# EAGLE design Hypnos V2_2.24 (EAGLE 9.5.2)
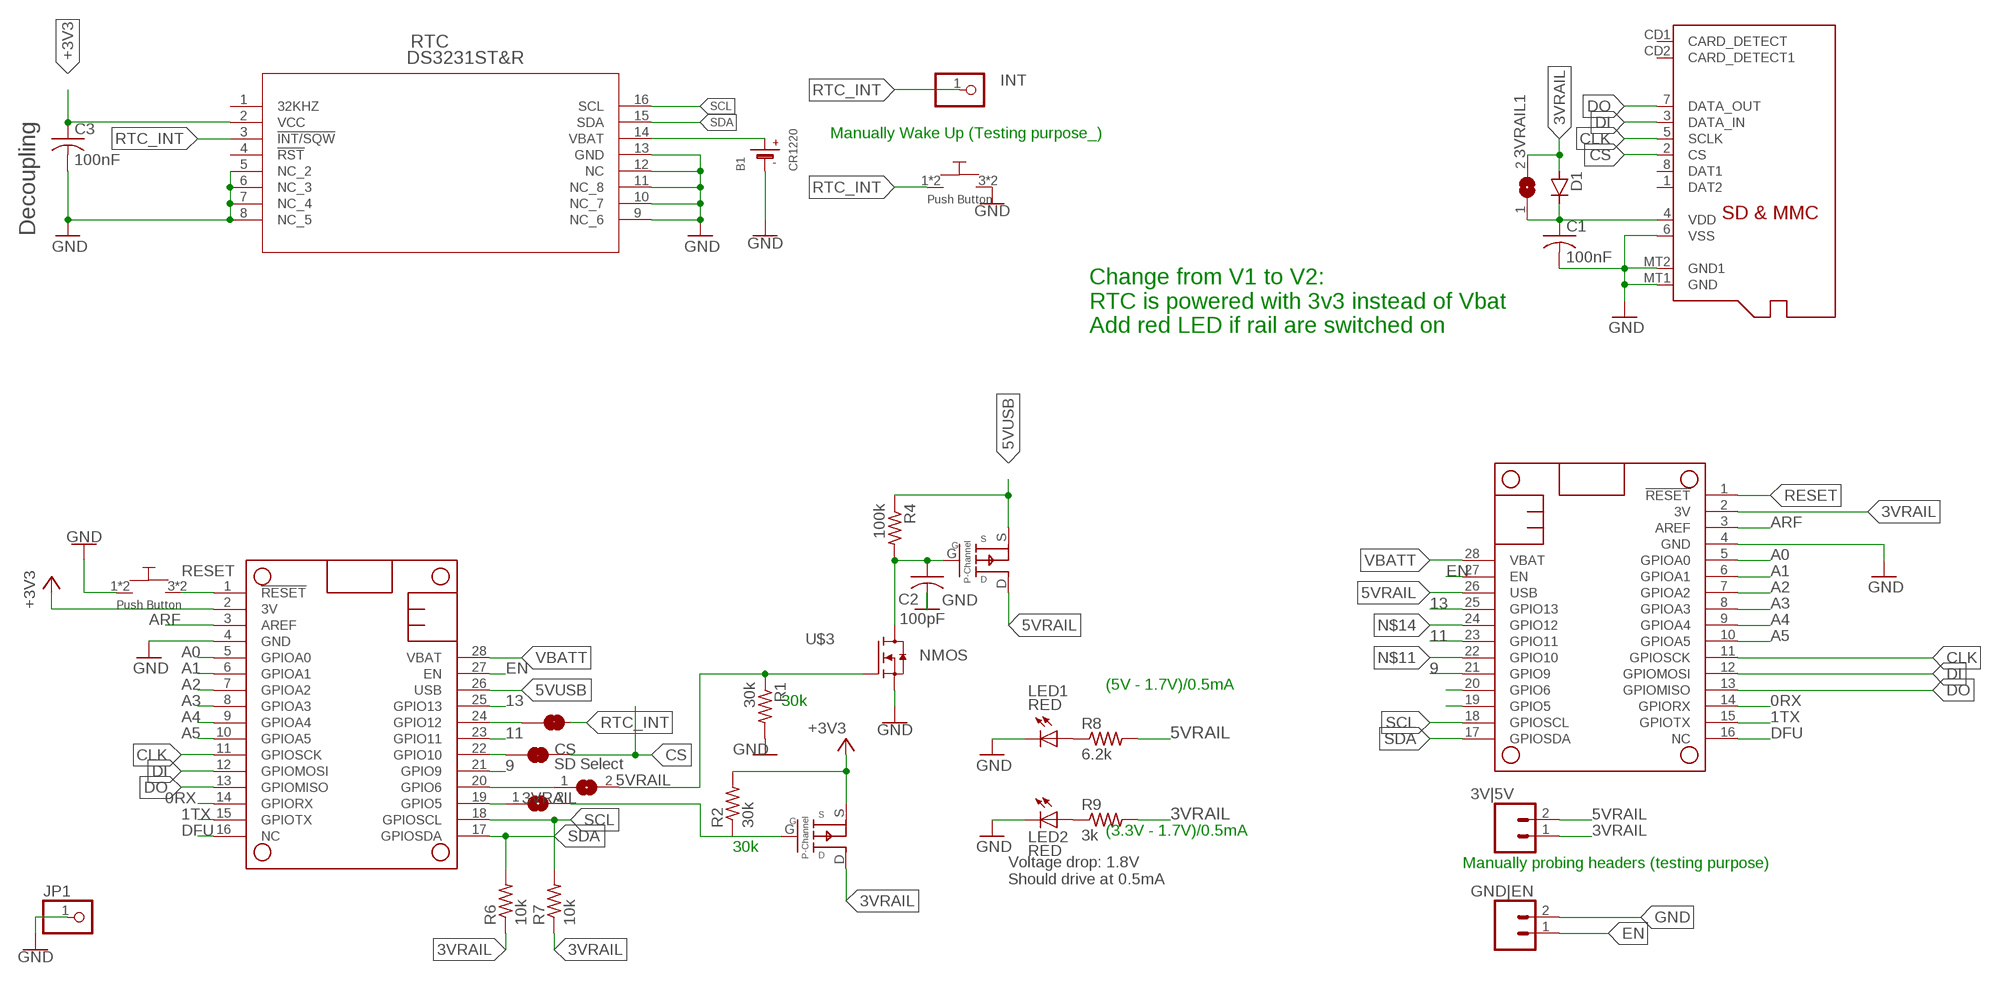
[diagram p0: schematic, sheet 1]

## Parts
3VRAIL  SJ  [SJ]
3VRAIL1  SJ  [SJ]
3V|5V  CONN_021X02_NO_SILK  [1X02_NO_SILK]
5VRAIL  SJ  [SJ]
B1  CR1220  BATTERYCR1220_SMT  [CR1220]
C1  100nF  C-USC1206  [C1206]
C2  100pF  C-USC0805  [C0805]
C3  100nF  C-USC1206  [C1206]
CS  SD Select  JUMPER-SMT_2_NC_TRACE_SILK  [SMT-JUMPER_2_NC_TRACE_SILK]
D1  D-SOD123  [SOD123]
GND|EN  CONN_021X02_NO_SILK  [1X02_NO_SILK]
INT  PINHD-1X1CB  [1X01-CLEANBIG]
JP1  PINHD-1X1CB  [1X01-CLEANBIG]
LED1  RED  LEDCHIPLED_0805  [CHIPLED_0805]
LED2  RED  LEDCHIPLED_0805  [CHIPLED_0805]
MICROSD  MICROSD  [MICROSD]
MS1  FEATHERWING  [FEATHERWING]
MS2  FEATHERWING  [FEATHERWING]
PMOS1  SSM3J3228R  [SOT-23-3]
PMOS2  SSM3J3228R  [SOT-23-3]
R1  30k  WSLP1206R0500FEA  [RES_1206]
R2  30k  WSLP1206R0500FEA  [RES_1206]
R4  100k  WSLP1206R0500FEA  [RES_1206]
R6  10k  WSLP1206R0500FEA  [RES_1206]
R7  10k  WSLP1206R0500FEA  [RES_1206]
R8  6.2k  WSLP1206R0500FEA  [RES_1206]
R9  3k  WSLP1206R0500FEA  [RES_1206]
RTC  DS3231ST&R  [21-0042B_16]
RTC_INT  JUMPER-SMT_2_NC_TRACE_SILK  [SMT-JUMPER_2_NC_TRACE_SILK]
U$1  PUSH_BUTTON  [PUSHBUTTON_SMD]
U$2  PUSH_BUTTON  [PUSHBUTTON_SMD]
U$3  NMOS  [SOT23-S]

## Nets
0RX: MS1.14(GPIORX) MS2.14(GPIORX)
1TX: MS1.15(GPIOTX) MS2.15(GPIOTX)
3VRAIL: 3VRAIL1.2 3V|5V.1 D1.2(A) MS1.2(3V) PMOS2.D R6.1 R7.1 R9.2
5VRAIL: 3V|5V.2 MS1.26(USB) PMOS1.D R8.2
5VUSB: MS2.26(USB) PMOS1.S R4.1
9: MS1.21(GPIO9) MS2.21(GPIO9)
11: MS1.23(GPIO11) MS2.23(GPIO11)
13: MS1.25(GPIO13) MS2.25(GPIO13)
+3V3: C3.1 MS2.2(3V) PMOS2.S R2.2 RTC.2(VCC)
A0: MS1.5(GPIOA0) MS2.5(GPIOA0)
A1: MS1.6(GPIOA1) MS2.6(GPIOA1)
A2: MS1.7(GPIOA2) MS2.7(GPIOA2)
A3: MS1.8(GPIOA3) MS2.8(GPIOA3)
A4: MS1.9(GPIOA4) MS2.9(GPIOA4)
A5: MS1.10(GPIOA5) MS2.10(GPIOA5)
ARF: MS1.3(AREF) MS2.3(AREF)
CLK: MICROSD.5(SCLK) MS1.11(GPIOSCK) MS2.11(GPIOSCK)
CS: CS.2 MICROSD.2(CS)
DFU: MS1.16(NC) MS2.16(NC)
DI: MICROSD.3(DATA_IN) MS1.12(GPIOMOSI) MS2.12(GPIOMOSI)
DO: MICROSD.7(DATA_OUT) MS1.13(GPIOMISO) MS2.13(GPIOMISO)
EN: GND|EN.1 MS1.27(EN) MS2.27(EN)
GND: B1.- C1.2 C2.2 C3.2 GND|EN.2 JP1.1 LED1.C LED2.C MICROSD.6(VSS) MICROSD.MT1(GND) MICROSD.MT2(GND1) MS1.4(GND) MS2.4(GND) R1.2 RTC.5(NC_2) RTC.6(NC_3) RTC.7(NC_4) RTC.8(NC_5) RTC.9(NC_6) RTC.10(NC_7) RTC.11(NC_8) RTC.12(NC) RTC.13(GND) U$1.1 U$1.2 U$2.3 U$2.4 U$3.2(S)
N$1: 5VRAIL.1 MS2.20(GPIO6)
N$2: B1.+$1(+) RTC.14(VBAT)
N$3: 3VRAIL.1 MS2.19(GPIO5)
N$4: 5VRAIL.2 R1.1 U$3.1(G)
N$5: 3VRAIL.2 PMOS2.G R2.1
N$7: MS1.20(GPIO6)
N$8: MS1.19(GPIO5)
N$10: C2.1 PMOS1.G R4.2 U$3.3(D)
N$11: CS.1 MS1.22(GPIO10) MS2.22(GPIO10)
N$12: LED1.A R8.1
N$13: LED2.A R9.1
N$14: MS1.24(GPIO12) MS2.24(GPIO12) RTC_INT.1
RESET: MS1.1(!RESET) MS2.1(!RESET) U$1.3 U$1.4
RTC_INT [sig]: INT.1 RTC.3(!INT/SQW) RTC_INT.2 U$2.1 U$2.2
SCL: MS1.18(GPIOSCL) MS2.18(GPIOSCL) R7.2 RTC.16(SCL)
SDA: MS1.17(GPIOSDA) MS2.17(GPIOSDA) R6.2 RTC.15(SDA)
VBATT [sig]: MS1.28(VBAT) MS2.28(VBAT)
VDD: 3VRAIL1.1 C1.1 D1.1(C) MICROSD.4(VDD)
Unconnected: MICROSD.1(DAT2) MICROSD.8(DAT1) MICROSD.CD1(CARD_DETECT) MICROSD.CD2(CARD_DETECT1) RTC.1(32KHZ) RTC.4(!RST)

## Notes on the sheet
- Manually Wake Up (Testing purpose_)
- Decoupling
- Change from V1 to V2:
  RTC is powered with 3v3 instead of Vbat
  Add red LED if rail are switched on
- (5V - 1.7V)/0.5mA
- 30k
- (3.3V - 1.7V)/0.5mA
- 30k
- Manually probing headers (testing purpose)
- Voltage drop: 1.8V
  Should drive at 0.5mA

## Library data of the parts
3VRAIL 3VRAIL1 5VRAIL = jumper:SJ: SMD solder JUMPER
3V|5V GND|EN = SparkFun-Connectors:CONN_02: Multi connection point. Often used as Generic Header-pin footprint for 0.1 inch spaced/style header connections On any of the 0.1 inch spaced packages, you can populate with these: Break Away Headers - Straight <https://www.sparkfun.com/products/116> (PRT-00116) Break Away Male Headers - Right Angle <https://www.sparkfun.com/products/553> (PRT-00553) Female Headers <https://www.sparkfun.com/products/115> (PRT-00115) Break Away Headers - Machine Pin <https://www.sparkfun.com/products/117> (PRT-00117) Break Away Female Headers - Swiss Machine Pin <https://www.sparkfun.com/products/743> (PRT-00743) For SCREWTERMINALS and SPRING TERMINALS visit here: Screw Terimnals on SparkFun.com <https://www.sparkfun.com/search/results?term=Screw+Terminals> (5mm/3.5mm/2.54mm spacing) This device is also useful as a general connection point to wire up your design to another part of your project. Our various solder wires solder well into these plated through hole pads. Hook-Up Wire - Assortment (Stranded, 22 AWG) <https://www.sparkfun.com/products/11375> (PRT-11375) Hook-Up Wire - Assortment (Solid Core, 22 AWG) <https://www.sparkfun.com/products/11367> (PRT-11367) View the entire wire category on our website here <https://www.sparkfun.com/categories/141> Special notes: Molex polarized connector foot print use with: PRT-08233 with associated crimp pins and housings. 2.54_SCREWTERM for use with PRT-10571. 3.5mm Screw Terminal footprints for PRT-08084 5mm Screw Terminal footprints for use with PRT-08432
B1 = microbuilder:BATTERY: CR1220 SMT - Digikey: 3001K-ND CD2032 BAT-HLD-001 - Digikey: BAT-HLD-001-ND
C1-C3 = resistor:C-US: CAPACITOR, American symbol
CS RTC_INT = SparkFun-Jumpers:JUMPER-SMT_2_NC_TRACE: Normally closed trace jumper This jumper has a trace between two pads so it's normally closed (NC). Use a razor knife to open the connection. For best results follow the IPC guidelines for cutting traces: Cutout at least 0.063 mm (0.005 in). Remove all loose material to clean up the cut area. Seal the cut with an approved epoxy. Reapply solder to reclose the connection.
D1 = semicon-smd-ipc:D-: DIODE unfilled
INT JP1 = adafruit:PINHD-1X1: Pin header 1x1 for 0.1" spacing With round pins
LED1 LED2 = adafruit:LED: LED OSRAM: - CHIPLED LG R971, LG N971, LY N971, LG Q971, LY Q971, LO R971, LY R971 LH N974, LH R974 LS Q976, LO Q976, LY Q976 LO Q996 - Hyper CHIPLED LW Q18S LB Q993, LB Q99A, LB R99A - SideLED LS A670, LO A670, LY A670, LG A670, LP A670 LB A673, LV A673, LT A673, LW A673 LH A674 LY A675 LS A676, LA A676, LO A676, LY A676, LW A676 LS A679, LY A679, LG A679 - Hyper Micro SIDELED® LS Y876, LA Y876, LO Y876, LY Y876 LT Y87S - SmartLED LW L88C, LW L88S LB L89C, LB L89S, LG L890 LS L89K, LO L89K, LY L89K LS L896, LA L896, LO L896, LY L896 - TOPLED LS T670, LO T670, LY T670, LG T670, LP T670 LSG T670, LSP T670, LSY T670, LOP T670, LYG T670 LG T671, LOG T671, LSG T671 LB T673, LV T673, LT T673, LW T673 LH T674 LS T676, LA T676, LO T676, LY T676, LB T676, LH T676, LSB T676, LW T676 LB T67C, LV T67C, LT T67C, LS T67K, LO T67K, LY T67K, LW E67C LS E67B, LA E67B, LO E67B, LY E67B, LB E67C, LV E67C, LT E67C LW T67C LS T679, LY T679, LG T679 LS T770, LO T770, LY T770, LG T770, LP T770 LB T773, LV T773, LT T773, LW T773 LH T774 LS E675, LA E675, LY E675, LS T675 LS T776, LA T776, LO T776, LY T776, LB T776 LHGB T686 LT T68C, LB T68C - Hyper Mini TOPLED® LB M676 - Mini TOPLED Santana® LG M470 LS M47K, LO M47K, LY M47K Source: http://www.osram.convergy.de/
MICROSD = adafruit:MICROSD: Micro-SD / Transflash card holder with SPI pinout For the 3M # 2908-05WB-MG and/or 4UCON #19656 push-push type
MS1 = powerboard:FEATHERWING
MS2 = adafruit:FEATHERWING
PMOS1 PMOS2 = M0_Power:SSM3J3228R: P-Channel MOSFET, SOT-23-3 SMD Package
R1 R2 R4 R6-R9 = Resistor_Capacitor:WSLP1206R0500FEA: RES 0.05 OHM 1% 1W 1206 Manufacturer's datasheet <http://www.vishay.com/docs/30122/wslp.pdf>; CREATED_BY: PCBLayout.com; DIGIKEY_PART_NUMBER: WSLP-.05TR-ND; MANUFACTURER: Vishay Dale; MPN: WSLP1206R0500FEA; PACKAGE: SMD 1206
RTC = power8:DS3231ST&R: DS3231 RTC IC only; MANUFACTURER_PART_NUMBER: DS3231S#T&R; VENDOR: Maxim Integrated Products
U$1 U$2 = eDNA:PUSH_BUTTON: SMD low profile push-button NOPE https://www.mouser.com/ProductDetail/ALPS/SKTHAHE010?qs=sGAEpiMZZMsgGjVA3toVBFPD9IcV2kPoEtmOqlcDILk%3D https://www.digikey.com/product-detail/en/c-k/KMR731NG-LFS/CKN10687TR-ND/6035353 https://www.arrow.com/en/products/kmr731nglfs/ck https://www.mouser.com/ProductDetail/CK/KMR731NGLFS?qs=%2Fha2pyFaduiYmAh2YH01EjoHSsd%2F4x%252BsVgk0GVi4JwmLxfMBh2nzdw%3D%3D
U$3 = eDNA:NMOS

## Net classes
3 sig: width 0.152 mm, clearance 0.152 mm

## Board
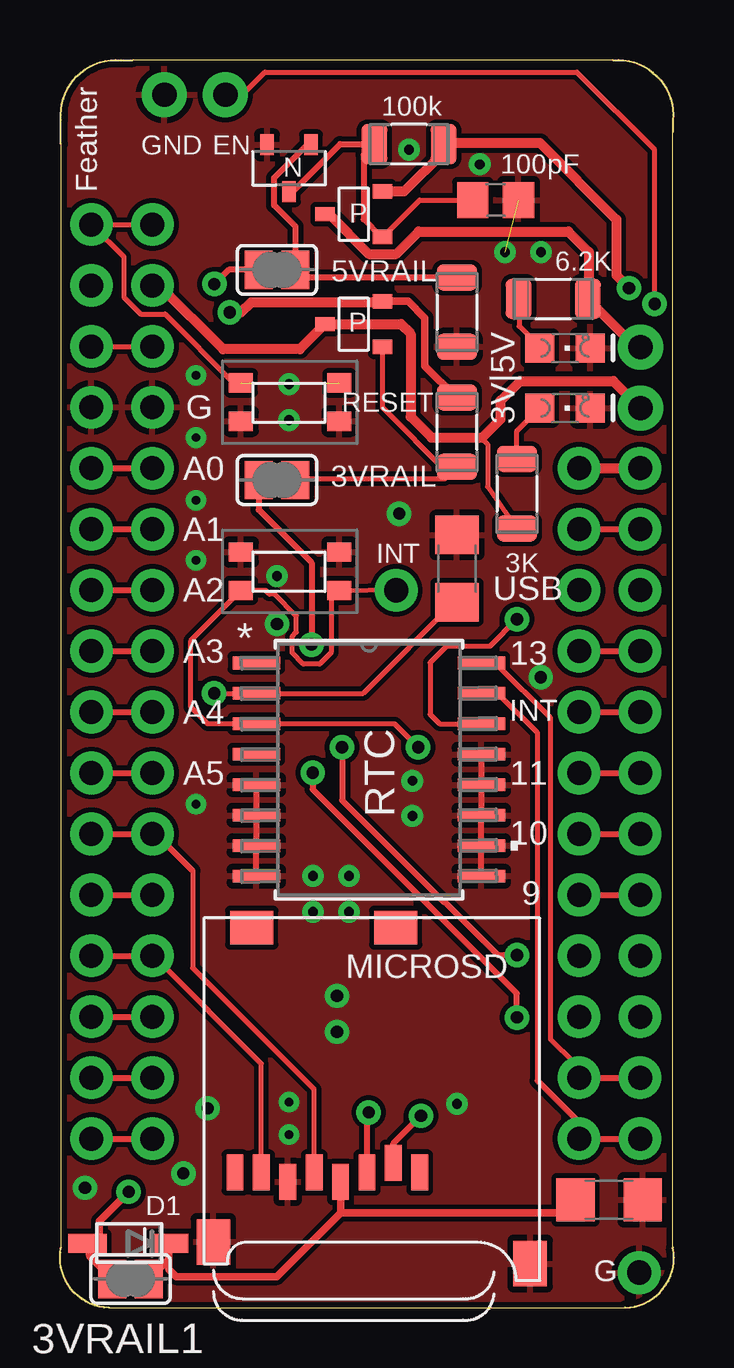
[diagram p1: board, top side]
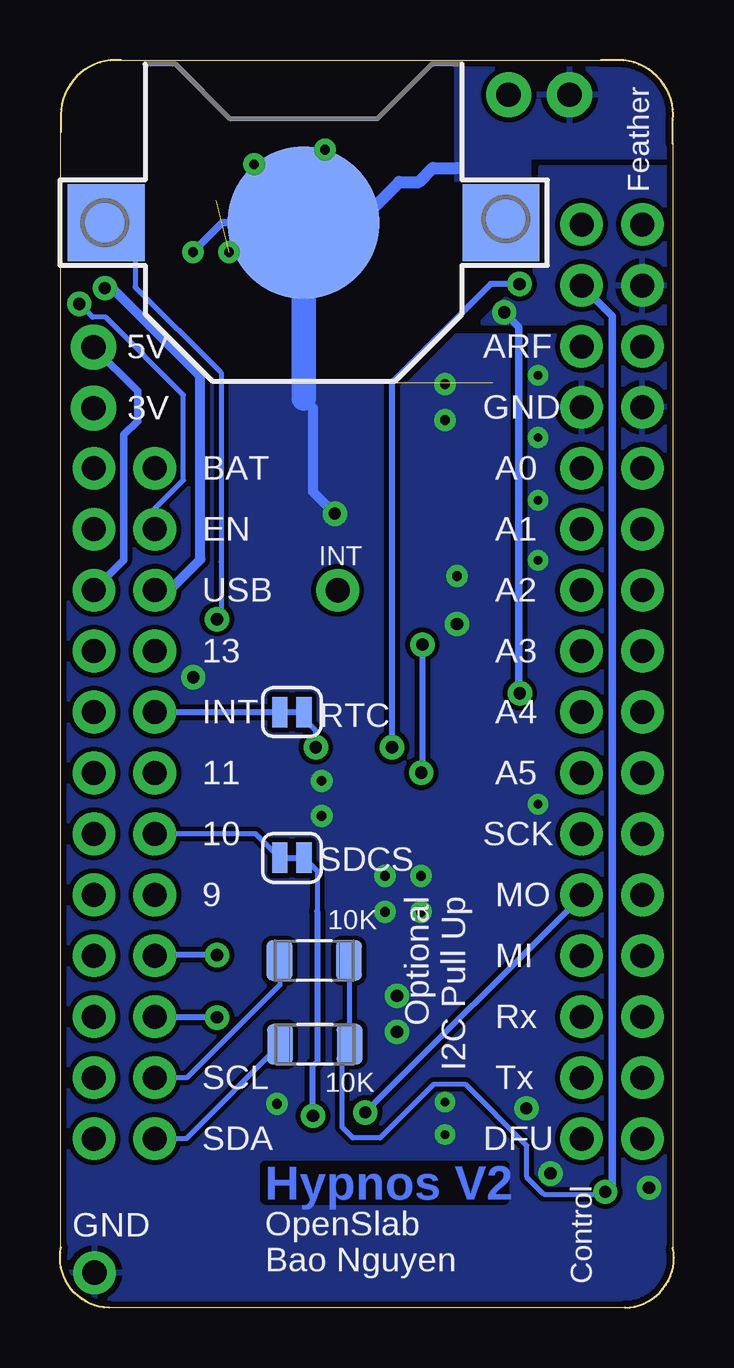
[diagram p2: board, bottom side, seen from below]

Size 25.58 x 52.01 mm. Coordinates in mm from the lower left corner, seen from the top.
Outline: 2.04,0 23.54,0 arc100 25.54,2.5 25.54,49 25.54,49.5 arc100 23.04,52 3.04,52 2.54,52 arc100 0.04,49.5 0.04,48.5 0.04,2.5 arc100 2.04,0
Copper layers (1*16): Top 0.035mm / dielectric 1.5mm / Bottom 0.035mm
Design rules "SparkFun": minimum track width 8mil, minimum drill 20mil, track to track 8mil, track to pad 8mil, pad to pad 8mil, via to via 8mil, smd to smd 8mil, copper to edge 10mil, drill to drill 8mil, minimum pad ring 12mil, minimum via ring 10mil, stop-mask expansion 4mil, vias tented up to drill 25mil, thermal gap 10mil

### Footprints (pad centres in the part's own frame; a part is rotated, then mirrored left to right if it is on the bottom)
SJ = smd 1.168 x 1.6: 1 -0.762,0; 2 0.762,0
1X02_NO_SILK = drill 1.016 pad 1.88: 1 0,0; 2 2.54,0
CR1220 = smd 3.2 x 3.2: +$1 -8.225,0; +$2 8.225,0 | smd 6.35 x 6.35: - 0,0
C1206 = smd 1.6 x 1.8: 1 -1.4,0; 2 1.4,0
C0805 = smd 1.3 x 1.5: 1 -0.95,0; 2 0.95,0
SMT-JUMPER_2_NC_TRACE_SILK = smd 0.635 x 1.27: 1 -0.508,0; 2 0.508,0
SOD123 = smd 1.6 x 0.8: 1 -1.7,0; 2 1.7,0
1X01-CLEANBIG = drill 1.016 pad 1.778: 1 0,0
CHIPLED_0805 = smd 1.2 x 1.2: A 0,-1.05; C 0,1.05
MICROSD = smd 0.7 x 1.5: 1 9,-10.64; 2 7.9,-10.24; 3 6.8,-10.64; 4 5.7,-11.04; 5 4.6,-10.64; 6 3.5,-11.04; 7 2.4,-10.64; 8 1.3,-10.64 | smd 1.8 x 1.4: CD1 2,-0.44; CD2 8,-0.44 | smd 1.4 x 1.9: MT1 0.4,-13.54; MT2 13.6,-14.44
FEATHERWING = drill 1 pad 1.778: 1 6.35,1.27; 2 8.89,1.27; 3 11.43,1.27; 4 13.97,1.27; 5 16.51,1.27; 6 19.05,1.27; 7 21.59,1.27; 8 24.13,1.27; 9 26.67,1.27; 10 29.21,1.27; 11 31.75,1.27; 12 34.29,1.27; 13 36.83,1.27; 14 39.37,1.27; 15 41.91,1.27; 16 44.45,1.27; 17 44.45,21.59; 18 41.91,21.59; 19 39.37,21.59; 20 36.83,21.59; 21 34.29,21.59; 22 31.75,21.59; 23 29.21,21.59; 24 26.67,21.59; 25 24.13,21.59; 26 21.59,21.59; 27 19.05,21.59; 28 16.51,21.59
SOT-23-3 = smd 0.8 x 0.6: D 1.2,0; G -1.2,0.95; S -1.2,-0.95
RES_1206 = smd 1.08 x 1.68: 1 -1.445,0; 2 1.445,0
21-0042B_16 = smd 1.981 x 0.533: 1 -4.686,4.445; 2 -4.686,3.175; 3 -4.686,1.905; 4 -4.686,0.635; 5 -4.686,-0.635; 6 -4.686,-1.905; 7 -4.686,-3.175; 8 -4.686,-4.445; 9 4.686,-4.445; 10 4.686,-3.175; 11 4.686,-1.905; 12 4.686,-0.635; 13 4.686,0.635; 14 4.686,1.905; 15 4.686,3.175; 16 4.686,4.445
PUSHBUTTON_SMD = smd 1 x 0.8: 1 0,-1.6; 2 4.1,-1.6; 3 0,0; 4 4.1,0
SOT23-S = smd 0.88 x 0.569: 1 -0.975,0.915; 2 -0.975,-0.915; 3 0.975,0

### Placement (x,y rotation side)
3VRAIL  9.04,34.5 0 top
3VRAIL1  2.94,1.2 180 top
3V|5V  24.19,37.5 90 bottom
5VRAIL  9.04,43.26 0 top
B1  15.43,45.23 0 bottom
C1  22.88,4.5 0 top
C2  18.15,46.17 0 top
C3  16.54,30.81 90 top
CS  15.92,18.75 0 bottom
D1  2.84,2.68 180 top
GND|EN  6.89,50.56 180 top
INT  14.01,29.91 0 top
JP1  24.14,1.46 0 top
LED1  21.04,40 270 top
LED2  21.04,37.5 270 top
MICROSD  5.99,16.28 0 top
MS1  2.58,51.5 270 top
MS2  0.04,51.5 270 top
PMOS1  12.24,45.58 180 top
PMOS2  12.24,41 180 top
R1  16.54,41.5 270 top
R2  16.54,36.5 90 top
R4  14.54,48.5 180 top
R6  14.96,10.98 180 bottom
R7  14.99,14.47 180 bottom
R8  20.55,42.05 0 top
R9  19.04,33.93 270 top
RTC  12.87,22.43 0 top
RTC_INT  15.92,24.83 0 bottom
U$1  7.54,38.55 0 top
U$2  7.54,31.5 0 top
U$3  9.54,47.5 270 top

### Tracks (layer width: path | path; a pad name or v marks a point on that pad's centre or on a via)
0RX
  Top 0.254: MS2.14 MS1.14
1TX
  Top 0.254: MS2.15 MS1.15
3VRAIL  (via drill 0.51)
  Top 0.203: R9.2 17.82,34.23 17.82,35.99 17.54,36.27
  Top 0.305: 17.54,36.27 17.59,36.27 | v2.86,4.83 1.64,3.61 1.64,2.9 1.54,2.8 D1.2 1.24,2.14 3VRAIL1.2
  Top 0.406: 3V|5V.1 23.06,38.63 19.17,38.63 18.36,37.82 18.36,37.03 17.59,36.27 | 17.54,36.27 15.48,36.27 14.61,37.14 14.61,40.6 14.2,41 PMOS2.D 10,39.96 6.79,39.96 4.14,42.61 MS1.2
  Bottom 0.203: R7.1 13.52,14.44 R6.1 13.84,10.65 13.82,10.64 13.82,7.51 13.39,7.08 12.24,7.08 10.02,9.3 8.68,9.3 6.13,6.75 6.13,5.44 5.42,4.73 2.96,4.73 v2.86,4.83
  Bottom 0.305: MS1.2 2.58,41.34 2.58,5.11 v2.86,4.83
5VRAIL
  Top 0.305: 3V|5V.2 23.98,40.04
  Top 0.406: 23.98,40.04 R8.2 22.04,42.09 22.04,44 21.18,44.86 14.95,44.86 14.01,43.92 12.87,43.92 11.22,45.58 PMOS1.D
  Bottom 0.305: 3V|5V.2 22.35,38.2 22.35,36.96 22.93,36.39 22.93,31.16 MS1.26
5VUSB  (via drill 0.51)
  Top 0.406: PMOS1.S 14.34,46.53 15.99,48.17 R4.1 16.03,48.54 20,48.54 23.18,45.36 23.18,43.03 v23.71,42.5
  Bottom 0.406: MS2.26 21.02,29.91 19.73,31.2 19.73,38.82 23.41,42.5 v23.71,42.5
9
  Top 0.254: MS2.21 MS1.21
11
  Top 0.254: MS2.23 MS1.23
13
  Top 0.254: MS2.25 MS1.25
+3V3  (via drill 0.51)
  Top 0.203: v6.42,25.61 RTC.2 12.63,25.61 16.43,29.41 C3.1
  Top 0.305: 13.39,41.9 PMOS2.S 14.51,41.95 15.2,41.26 15.2,39.26 R2.2
  Top 0.406: v7.07,41.49 7.54,41.49 7.95,41.9 13.39,41.9
  Bottom 0.305: v6.42,25.61 6.46,25.65 6.46,40.88 v7.07,41.49
  pour Bottom: -1.06,41.08 -1.06,47.5 5.54,47.5 5.54,43.5 7.96,41.08
A0
  Top 0.254: MS2.5 MS1.5
A1
  Top 0.254: MS2.6 MS1.6
A2
  Top 0.254: MS2.7 MS1.7
A3
  Top 0.254: MS2.8 MS1.8
A4
  Top 0.254: MS2.9 MS1.9
A5
  Top 0.254: MS2.10 MS1.10
ARF
  Top 0.203: MS2.3 MS1.3
CLK
  Top 0.203: MICROSD.5 10.59,9.1 5.53,14.16 5.53,18.21
  Top 0.254: 5.53,18.21 3.99,19.75 MS1.11 MS2.11
CS  (via drill 0.51)
  Top 0.254: v15.04,8 13.89,6.85 MICROSD.2
  Bottom 0.203: CS.2 14.87,18.21 14.87,16.52
  Bottom 0.254: v15.04,8 15.04,10.08 14.87,10.25 14.87,16.52
DFU
  Top 0.254: MS2.16 MS1.16
DI  (via drill 0.51)
  Top 0.254: v12.86,8.14 12.79,8.07 MICROSD.3 | MS2.12 MS1.12
  Bottom 0.254: v12.86,8.14 3.85,17.15 MS1.12
DO
  Top 0.203: MS1.13 3.89,14.67 | MICROSD.7 8.39,10.17 4.05,14.51
  Top 0.254: MS2.13 3.89,14.67 4.05,14.51
EN  (via drill 0.51)
  Top 0.203: v24.78,41.84 24.78,48.26 21.54,51.5 8.54,51.5 7.6,50.56 GND|EN.1
  Top 0.254: MS2.27 MS1.27
  Bottom 0.203: v24.78,41.84 24.22,41.28 23.67,41.28 20.44,38.05 20.44,34.5 21.63,33.3 MS2.27
GND  (via drill 0.35, 0.4, 0.51)  (1 unrouted)
  Top 0.254: RTC.8 RTC.7 RTC.6 RTC.5 | RTC.9 RTC.10 RTC.11 RTC.12 RTC.13
  Bottom 0.203: B1.- 13.14,45.23
  Bottom 0.305: B1.- 18.81,45.23 v20.04,44
  Bottom 0.406: 15.43,37.89 15.04,37.5 15.04,34.01 v14.13,33.1
  Bottom 0.508: 13.14,45.23 11.45,46.92 10.62,46.92 10.04,47.5 9.04,47.5
  Bottom 1.016: B1.- 15.43,37.89
  other vias: 9.54,7.21 14.68,21.96 20.03,26.28 6.15,8.31 11.54,13 5.14,5.6 1.04,5 9.04,28.5 11.54,11.5 16.54,8.5 12.04,18 10.54,18 10.54,16.5 12.04,16.5 18.54,44 5.66,38.87 5.66,36.27 5.66,33.66 9.54,37 9.54,38.5 9.04,30.5 14.54,48.27 14.68,20.5 5.66,20.99 5.66,31.16 9.54,8.57 17.49,47.66
  pour Top: -0.46,52.5 26.04,52.5 26.04,-0.5 -0.46,-0.5
  pour Bottom: -1.06,40.5 9.04,40.5 11.04,38.5 19.04,38.5 22.04,41.5 22.04,53.4 26.74,53.4 26.74,-1.2 -1.06,-1.2
  pour Bottom: -1.06,48 -1.06,53.3 9.04,53.3 9.04,41 6.04,44 6.04,48
N$1  (via drill 0.51)
  Top 0.254: v19.04,14.7 18.24,14.7 16.03,16.91 15.99,16.91 11.75,21.15 v11.75,23.36 | 5VRAIL.1 7.02,43.26 v6.43,42.67
  Bottom 0.254: v6.43,42.67 7.64,42.67 11.75,38.56 v11.75,23.36 | v19.04,14.7 21.6,14.7 MS2.20
N$2  (via drill 0.51)
  Top 0.203: RTC.14 15.82,24.34 15.42,24.74 15.42,26.89 16.1,27.57 17.91,27.57 v19.04,28.7
  Bottom 0.203: v19.04,28.7 18.87,28.87 18.87,31.1 18.87,38.97 22.45,42.55 22.45,44.02 B1.+$1
N$3  (via drill 0.51)
  Top 0.254: 3VRAIL.1 8.28,33.26 10.48,31.06 v10.48,27.64 | v19.04,12.1 19.04,13.1 10.53,21.61 v10.53,22.3
  Bottom 0.254: v10.48,27.64 10.48,22.35 v10.53,22.3 | v19.04,12.1 21.6,12.1 MS2.19
N$4
  Top 0.254: U$3.1 10.3,48.47 8.93,47.1 8.93,45.95 9.8,45.07 5VRAIL.2 10.05,43.01 10.12,42.95 R1.1
N$5
  Top 0.203: 16.51,35.04 16.16,34.79 13.44,37.51 PMOS2.G | 16.51,35.04 R2.1 | 3VRAIL.2 9.86,34.56 16.04,34.56 16.51,35.04
N$10
  Top 0.203: PMOS1.G 14.98,46.17 C2.1
  Top 0.254: PMOS1.G 13.38,44.63 12.65,45.37 12.65,48.05 R4.2 11.67,48.5 9.7,46.53 U$3.3
N$11
  Top 0.254: MS2.22 MS1.22
  Bottom 0.203: CS.1 17.43,19.75 MS2.22
N$12
  Top 0.203: LED1.A 20.02,40.02 19.13,40.91 R8.1
N$13
  Top 0.203: R9.1 19.04,36.55 LED2.A
N$14
  Top 0.254: MS2.24 MS1.24
  Bottom 0.254: MS2.24 RTC_INT.1
RESET  (1 unrouted)
  Top 0.203: MS1.1 MS2.1 2.66,43.8 2.66,42.12 3.36,41.42 4.38,41.42 7.25,38.55 U$1.3
RTC_INT  (via drill 0.51)
  Top 0.203: v14.92,23.36 13.94,24.34 RTC.3 6.15,24.34 5.45,25.04 5.45,27.81 U$2.1 8.57,29.9 8.73,29.74 8.95,29.74 9.85,28.84 9.85,28.16 9.67,27.98 9.67,27.3 10.14,26.83 10.82,26.83 11.29,27.3 11.29,29.55 U$2.2 11.67,29.88 INT.1
  Bottom 0.203: RTC_INT.2 15.41,24.55 14.92,24.06 v14.92,23.36
SCL
  Top 0.203: RTC.16 17.62,26.82 18.21,26.82 20.43,24.59 20.43,11.19 21.42,10.2
  Top 0.254: MS1.18 MS2.18 21.63,9.99 21.42,10.2
  Bottom 0.203: R7.2 16.41,13.47 20.29,9.59 MS2.18
SDA
  Top 0.203: RTC.15 18.25,25.61 19.89,23.97 19.89,9.47
  Top 0.254: MS1.17 MS2.17 21.63,7.73 19.89,9.47
  Bottom 0.203: R6.2 20.31,7.05 MS2.17
VBATT
  Top 0.406: MS2.28 MS1.28
VDD
  Top 0.305: MICROSD.4 11.69,3.95 | 11.69,3.95 9.04,1.3 4.84,1.3 4.54,1.6 4.54,1.8 | 11.69,3.95 21,3.95 C1.1 | 4.54,1.8 4.54,2.58 D1.1 | 3VRAIL1.1 4.42,1.92 4.54,1.8

### Text on the board
Bottom: Hypnos V2
tPlace: 100k | GND | EN | N | 100pF | Feather | P | 6.2K | P | RESET | G | A0 | A1 | 3K | A2 | A3 | A4 | A5 | G
bPlace: Feather | ARF | 5V | GND | 3V | A0 | BAT | A1 | EN | INT | A2 | USB | A3 | 13 | RTC | A4 | INT | A5 | 11 | SCK | SDCS | 10 | Optional / I2C Pull Up | MO | 9 | 10K | MI | Rx | Tx | 10K | SCL | DFU | SDA | OpenSlab | GND | Control | Bao Nguyen
tNames: USB | 13 | INT | 11 | 10 | 9
bStop: Hypnos V2